# Altium project ESP32_Mega_Sensor.PrjPcb
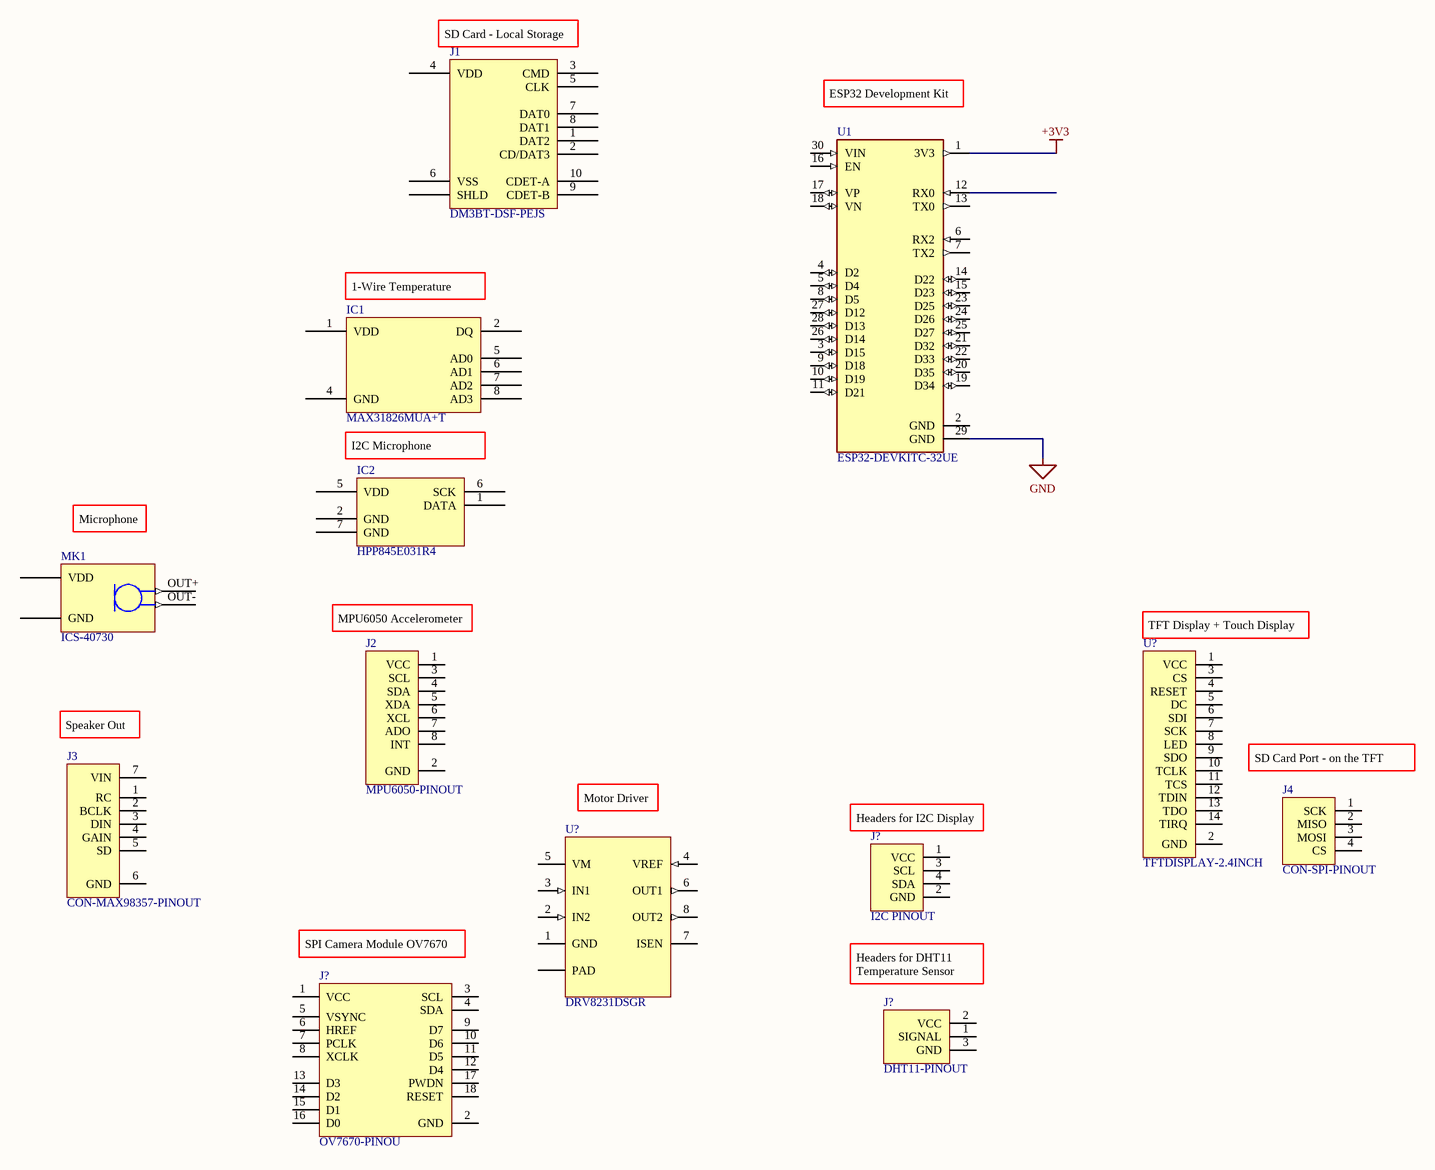
[diagram p0: MCU_Sensors.SchDoc]
1 sheet, 13 parts. Net scope: global (net labels, ports and power ports of the same name join across sheets).
Board file: ESP32_Mega_Sensors.PcbDoc

## Sheet MCU_Sensors.SchDoc
size A3; SheetNumber: 1; SheetTotal: 1

### Parts
(Parts that share a designator on the sheet are numbered #1, #2 ... from top to bottom, then left to right.)
IC1  MAX31826MUA+T  [MAXIM MSOP-8 uMAX]
IC2  HPP845E031R4  [TE HPP845E031R4]
J1  DM3BT-DSF-PEJS  [HIROSE DM3BT-DSF-PEJS]
J2  MPU6050-PINOUT  [MPU6050-BREAKOUT]
J3  CON-MAX98357-PINOUT  [MAX98357-BREAKOUT]
J4  CON-SPI-PINOUT  [SPI-BREAKOUT-PINOUT]
J?#1  I2C PINOUT  [I2C-BREAKOUT]
J?#2  DHT11-PINOUT  [DHT11-BREAKOUT]
J?#3  OV7670-PINOU  [OV7670-BREAKOUT]
MK1  ICS-40730  [TDK ICS-40730]
U1  ESP32-DEVKITC-32UE  [ESP32-DEVKITC-32UE]
U?#1  TFTDISPLAY-2.4INCH  [TFTDISPLAY-2.4INCH-SPI-BREAKOUT]
U?#2  DRV8231DSGR  [SON50P200X200X80-8]

### Nets
+3V3: U1.1(3V3)
GND: U1.29(GND)

Not connected (* = marked no-connect by the designer): IC1 1(VDD) 2(DQ) 4(GND) 5(AD0) 6(AD1) 7(AD2) 8(AD3); IC2 1(DATA) 2(GND) 5(VDD) 6(SCK) 7(GND); J1 1(DAT2) 2(CD/DAT3) 3(CMD) 4(VDD) 5(CLK) 6(VSS) 7(DAT0) 8(DAT1) 9(CDET-B) 10(CDET-A) S(SHLD); J2 1(VCC) 2(GND) 3(SCL) 4(SDA) 5(XDA) 6(XCL) 7(ADO) 8(INT); J3 1(RC) 2(BCLK) 3(DIN) 4(GAIN) 5(SD) 6(GND) 7(VIN); J4 1(SCK) 2(MISO) 3(MOSI) 4(CS); J?#1 1(VCC) 2(GND) 3(SCL) 4(SDA); J?#2 1(SIGNAL) 2(VCC) 3(GND); J?#3 1(VCC) 2(GND) 3(SCL) 4(SDA) 5(VSYNC) 6(HREF) 7(PCLK) 8(XCLK) 9(D7) 10(D6) 11(D5) 12(D4) 13(D3) 14(D2) 15(D1) 16(D0) 17(PWDN) 18(RESET); MK1 G(GND) OUT+ OUT- VDD; U1 2(GND) 3(D15) 4(D2) 5(D4) 6(RX2) 7(TX2) 8(D5) 9(D18) 10(D19) 11(D21) 12(RX0) 13(TX0) 14(D22) 15(D23) 16(EN) 17(VP) 18(VN) 19(D34) 20(D35) 21(D32) 22(D33) 23(D25) 24(D26) 25(D27) 26(D14) 27(D12) 28(D13) 30(VIN); U?#1 1(VCC) 2(GND) 3(CS) 4(RESET) 5(DC) 6(SDI) 7(SCK) 8(LED) 9(SDO) 10(TCLK) 11(TCS) 12(TDIN) 13(TDO) 14(TIRQ); U?#2 1(GND) 2(IN2) 3(IN1) 4(VREF) 5(VM) 6(OUT1) 7(ISEN) 8(OUT2) PAD

### Notes on the sheet
- (near J1) SD Card - Local Storage
- (near U1) ESP32 Development Kit
- (near IC1) 1-Wire Temperature Sensor
- I2C Microphone
- (near MK1) Microphone
- (near J2) MPU6050 Accelerometer
- (near U?#1) TFT Display + Touch Display
- (near J3) Speaker Out
- SD Card Port - on the TFT Display
- (near U?#2) Motor Driver
- (near J?#1) Headers for I2C Display
- (near J?#3) SPI Camera Module OV7670
- (near J?#2) Headers for DHT11 Temperature Sensor

### Library data of the parts
IC1 = MAX31826MUA+T: SENSOR DIGITAL -55C-125C 8UMAX; Manufacturer: Maxim Integrated; Accuracy - Highest (Lowest): ±0.5°C (±2°C); Output Type: 1-Wire®; Resolution: 11 b; Sensing Temperature - Local: -55°C ~ 125°C; Sensor Type: Digital, Local; Test Condition: 10°C ~ 85°C (-55°C ~ 125°C); Voltage - Supply: 3V ~ 3.7V; Part Number: MAX31826MUA+T; ComponentLink1Description: Datasheet; ComponentLink1URL: https://datasheets.maximintegrated.com/en/ds/MAX31826.pdf; ComponentLink2Description: DigiKey Link; ComponentLink2URL: http://digikey.com/product-detail/en/maxim-integrated/MAX31826MUA-T/MAX31826MUA-TCT-ND/8021036; Device Package: 8-TSSOP, 8-MSOP (0.118", 3.00mm Width); LastUpdated: 25/05/2020 5:41:30 pm; Lifecycle Status: Active; Minimum Order: 1; Mounting Type: Surface Mount; Operating Temperature: -55°C ~ 125°C; Package / Case: 8-TSSOP, 8-MSOP (0.118", 3.00mm Width); Packaging: TapeAndReel; Part Status: Active; Price: 2.10; Series: -; Supplier 1: DigiKey; Supplier Part Number 1: MAX31826MUA+TCT-ND; Supplier Device Package: 8-uMAX
IC2 = HPP845E031R4: SENSOR HUMID/TEMP 3V I2C 2% SMD; Manufacturer: TE Connectivity Measurement Specialties; Accuracy: ±2% RH; Humidity Range: 0 ~ 100% RH; Output: 12b; Output Type: I²C; Response Time: 5s; Sensor Type: Humidity, Temperature; Voltage - Supply: 1.5V ~ 3.6V; Part Number: HPP845E031R4; ComponentLink1Description: Datasheet; ComponentLink1URL: https://www.te.com/commerce/DocumentDelivery/DDEController?Action=srchrtrv&DocNm=HPC199_6&DocType=Data+Sheet&DocLang=English; ComponentLink2Description: DigiKey Link; ComponentLink2URL: http://digikey.com/product-detail/en/te-connectivity-measurement-specialties/HPP845E031R4/223-1144-1-ND/3945773; Device Package: 6-VDFN Exposed Pad; LastUpdated: 24/05/2020 10:55:13 pm; Lifecycle Status: Active; Minimum Order: 1; Mounting Type: Surface Mount; Operating Temperature: -40°C ~ 125°C; Package / Case: 6-VDFN Exposed Pad; Packaging: TapeAndReel; Part Status: Active; Price: 2.87; Series: HTU; Supplier 1: DigiKey; Supplier Part Number 1: 223-1144-1-ND; Supplier Device Package: 6-DFN (3x3)
J1 = DM3BT-DSF-PEJS: CONN MICRO SD CARD PUSH-PUSH R/A; Manufacturer: Hirose Electric Co Ltd; Card Type: Secure Digital - microSD™; Connector Type: Connector and Ejector; Insertion, Removal Method: Push In, Push Out; Number of Positions: 10 (8 + 2); Part Number: DM3BT-DSF-PEJS; ComponentLink1Description: Datasheet; ComponentLink1URL: https://www.hirose.com/product/download/?distributor=digikey&type=specSheet&lang=en&num=DM3BT-DSF-PEJS; ComponentLink2Description: DigiKey Link; ComponentLink2URL: //digikey.com/product-detail/en/hirose-electric-co-ltd/DM3BT-DSF-PEJS/HR1942TR-ND/1982749; Contact Finish: Gold; Features: Switch; Height Above Board: 0.072" (1.83mm); LastUpdated: 16/12/2019 8:35:34 pm; Lifecycle Status: 0; Minimum Order: 1; Mounting Feature: Reverse - Bottom; Mounting Type: Surface Mount, Right Angle; Packaging: TapeAndReel; Part Status: Active; Price: 1.25; Series: DM3; Supplier 1: DigiKey; Supplier Part Number 1: HR1942TR-ND
J2 = CON-MPU6050-PINOUT: MPU6050-PINOUT-ACCELEROMETER-GYROSCOPE
J3 = CON-MAX98357-PINOUT: MAX98357A I2S 3W Class D Amplifier Breakout Interface I2S DAC Decoder for Audio
J?#1 = CON-I2C-PINOUT
J?#2 = CON-DHT11-PINOUT
J?#3 = CON-OV7670-PINOUT: OV7670 camera module OV7670 moduleSupports VGA CIF auto exposure control display active size 640X480 For Arduino
MK1 = ICS-40730: ULTRA-LOW NOISE MICROPHONE WITH; Manufacturer: TDK InvenSense; Current - Supply: 285µA; Direction: Noise Cancelling; Frequency Range: 25Hz ~ 20kHz; Impedance: 750 Ohms; Output Type: Analog; Port Location: Bottom; Sensitivity: -32dB ±2dB @ 124dB SPL; Shape: Rectangular; S/N Ratio: 74dB; Voltage Range: 1.5V ~ 3.63V; Part Number: ICS-40730; ComponentLink1Description: Datasheet; ComponentLink1URL: http://www.invensense.com/wp-content/uploads/2018/12/DS-000139-ICS-40730-v1.0.pdf?ref_disty=digikey; ComponentLink2Description: DigiKey Link; ComponentLink2URL: http://digikey.com/product-detail/en/tdk-invensense/ICS-40730/1428-1141-1-ND/8576081; Height (Max): 0.142" (3.60mm); LastUpdated: 24/04/2020 12:45:53 am; Lifecycle Status: Active; Minimum Order: 1; Packaging: TapeAndReel; Part Status: Active; Price: 1.76; Series: ICS-40730; Size / Dimension: 0.186" L x 0.148" W (4.72mm x 3.76mm); Supplier 1: DigiKey; Supplier Part Number 1: 1428-1141-1-ND; Termination: Solder Pads; Type: MEMS (Silicon)
U1 = ITC-ESP32-DEVKITC: ESP32-WROOM-32UE 4MB FLASH
U?#1 = CON-TFTDISPLAY-2.4INCH-SPI-BREAKOUT: TFT Display 0.96/1.3/1.44/1.8/2.4/2.8 Inch IPS 7P SPI HD 65K TFT Full Color LCD Module ST7735 Drive IC 80*160 For Arduino
U?#2 = ITC-DRV8231DSGR: 33V H BRIDGE MOTOR DRIVER, CHARGE PUMP, SMD 8-WSON